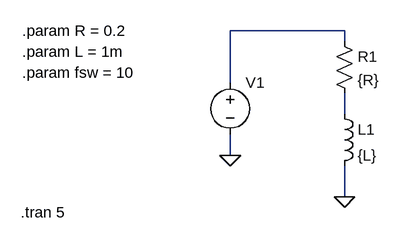
[diagram p0: schematic Draft1.asc]
Draft1.asc, the LTspice schematic file:
Version 4
SHEET 1 936 680
WIRE 272 16 96 16
WIRE 272 32 272 16
WIRE 96 96 96 16
WIRE 272 144 272 112
WIRE 96 208 96 176
WIRE 272 272 272 224
FLAG 272 272 0
FLAG 96 208 0
SYMBOL ind 256 128 R0
SYMATTR InstName L1
SYMATTR Value {L}
SYMBOL res 256 16 R0
SYMATTR InstName R1
SYMATTR Value {R}
SYMBOL voltage 96 80 R0
WINDOW 3 24 96 Invisible 2
WINDOW 123 0 0 Left 0
WINDOW 39 0 0 Left 0
SYMATTR InstName V1
SYMATTR Value PULSE(-1 1 0 1n 1n {0.5/fsw} {1/fsw} 1e12)
TEXT -224 16 Left 2 !.param R = 0.2
TEXT -224 48 Left 2 !.param L = 1m
TEXT -224 80 Left 2 !.param fsw = 10
TEXT -226 296 Left 2 !.tran 5

The netlist it stands for:
* Draft1.asc
L1 N002 0 {L}
R1 N001 N002 {R}
V1 N001 0 PULSE(-1 1 0 1n 1n {0.5/fsw} {1/fsw} 1e12)
.param R = 0.2
.param L = 1m
.param fsw = 10
.tran 5
.backanno
.end